# Altium schematic sheet BRZ_BATT_MGR.SchDoc
size C; SheetNumber: 1; SheetTotal: 8
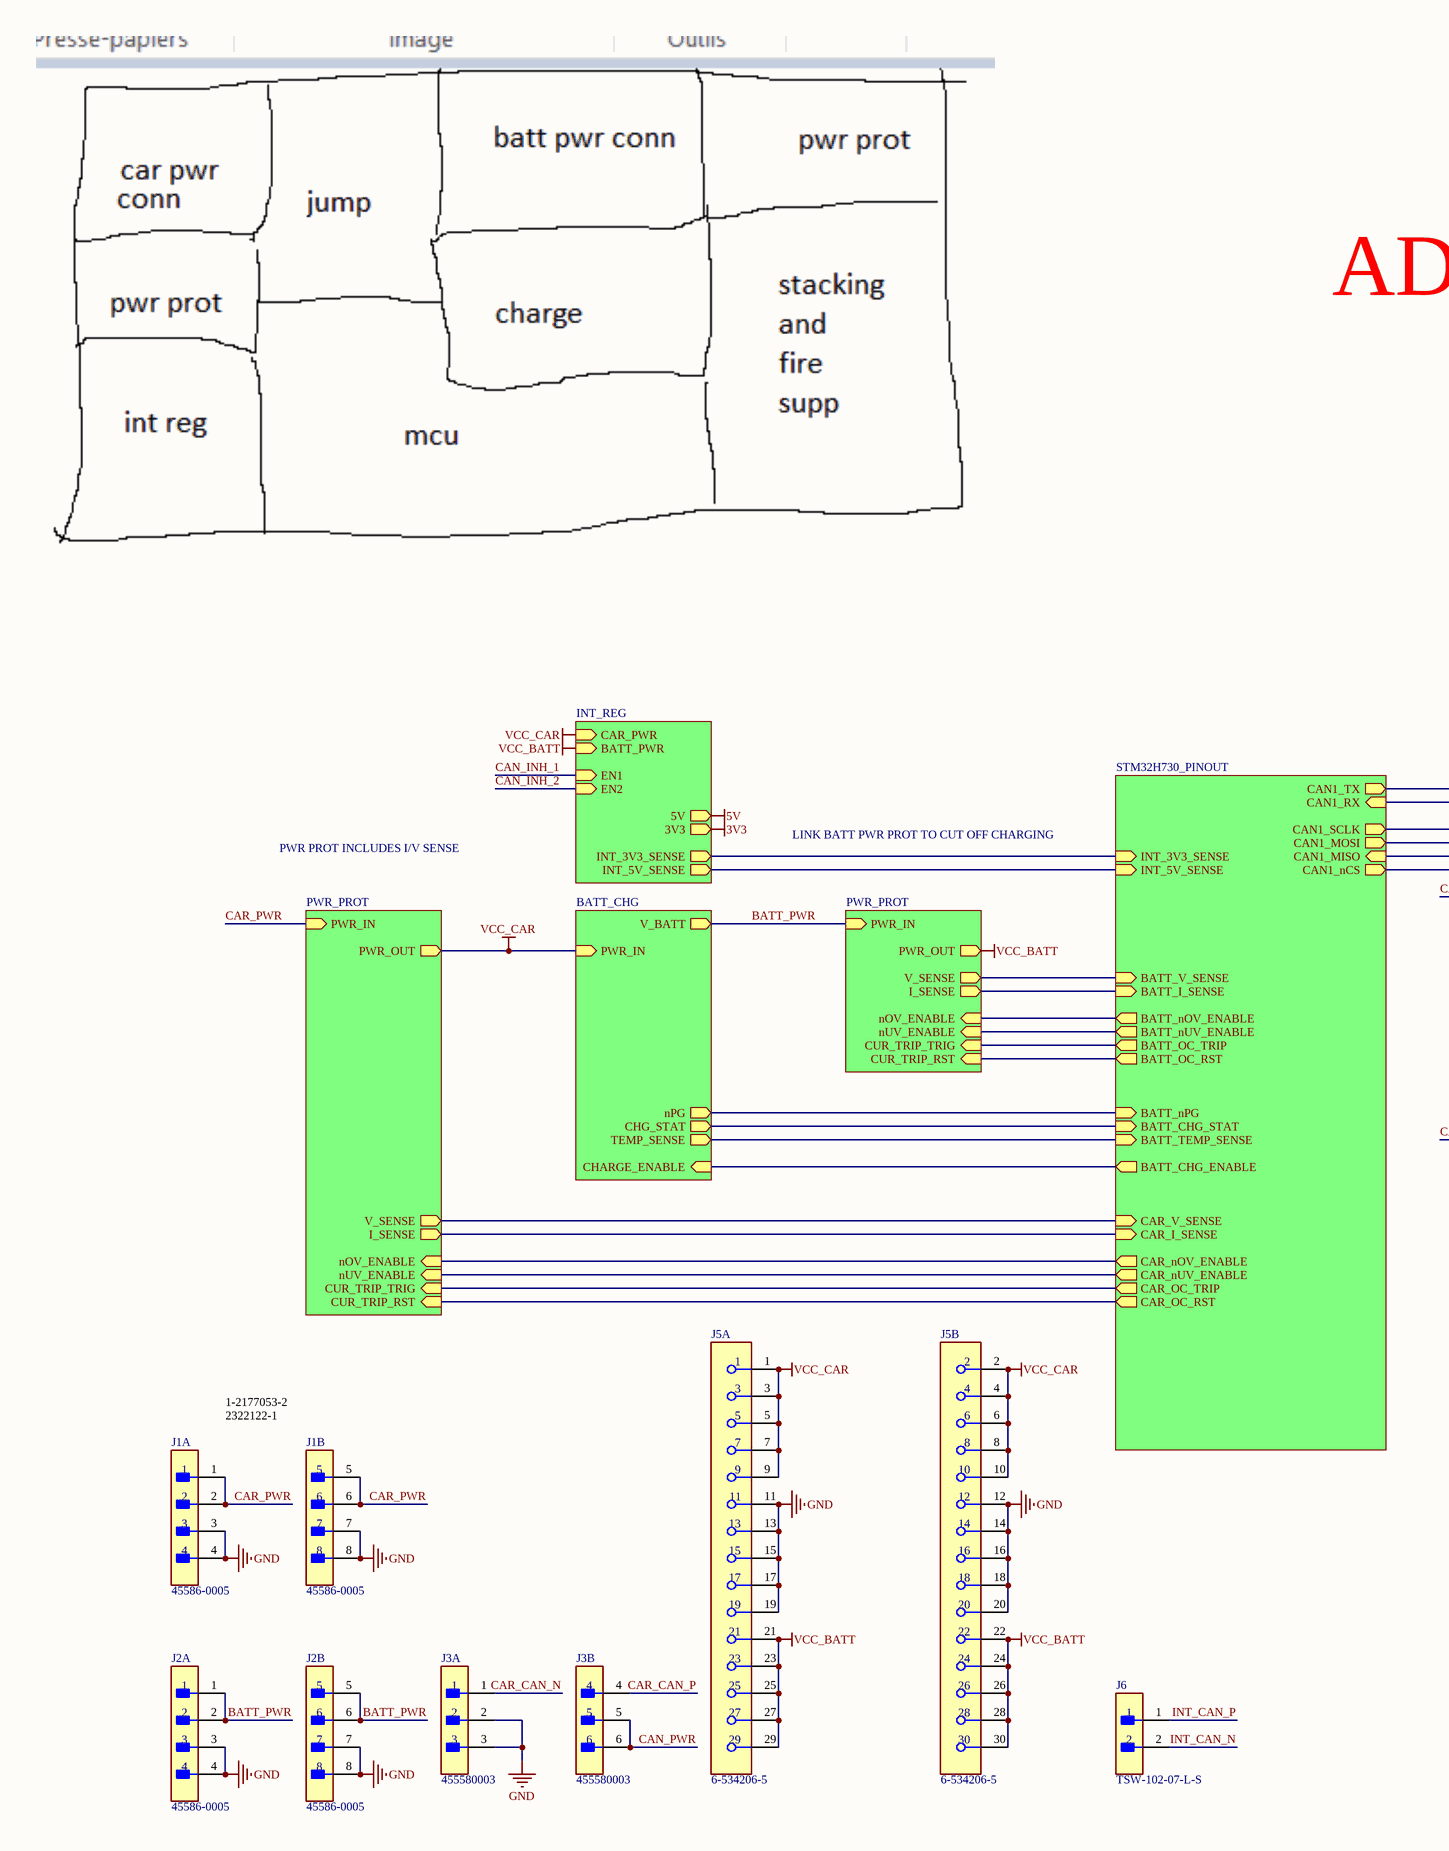
[diagram p0: BRZ_BATT_MGR.SchDoc, left]
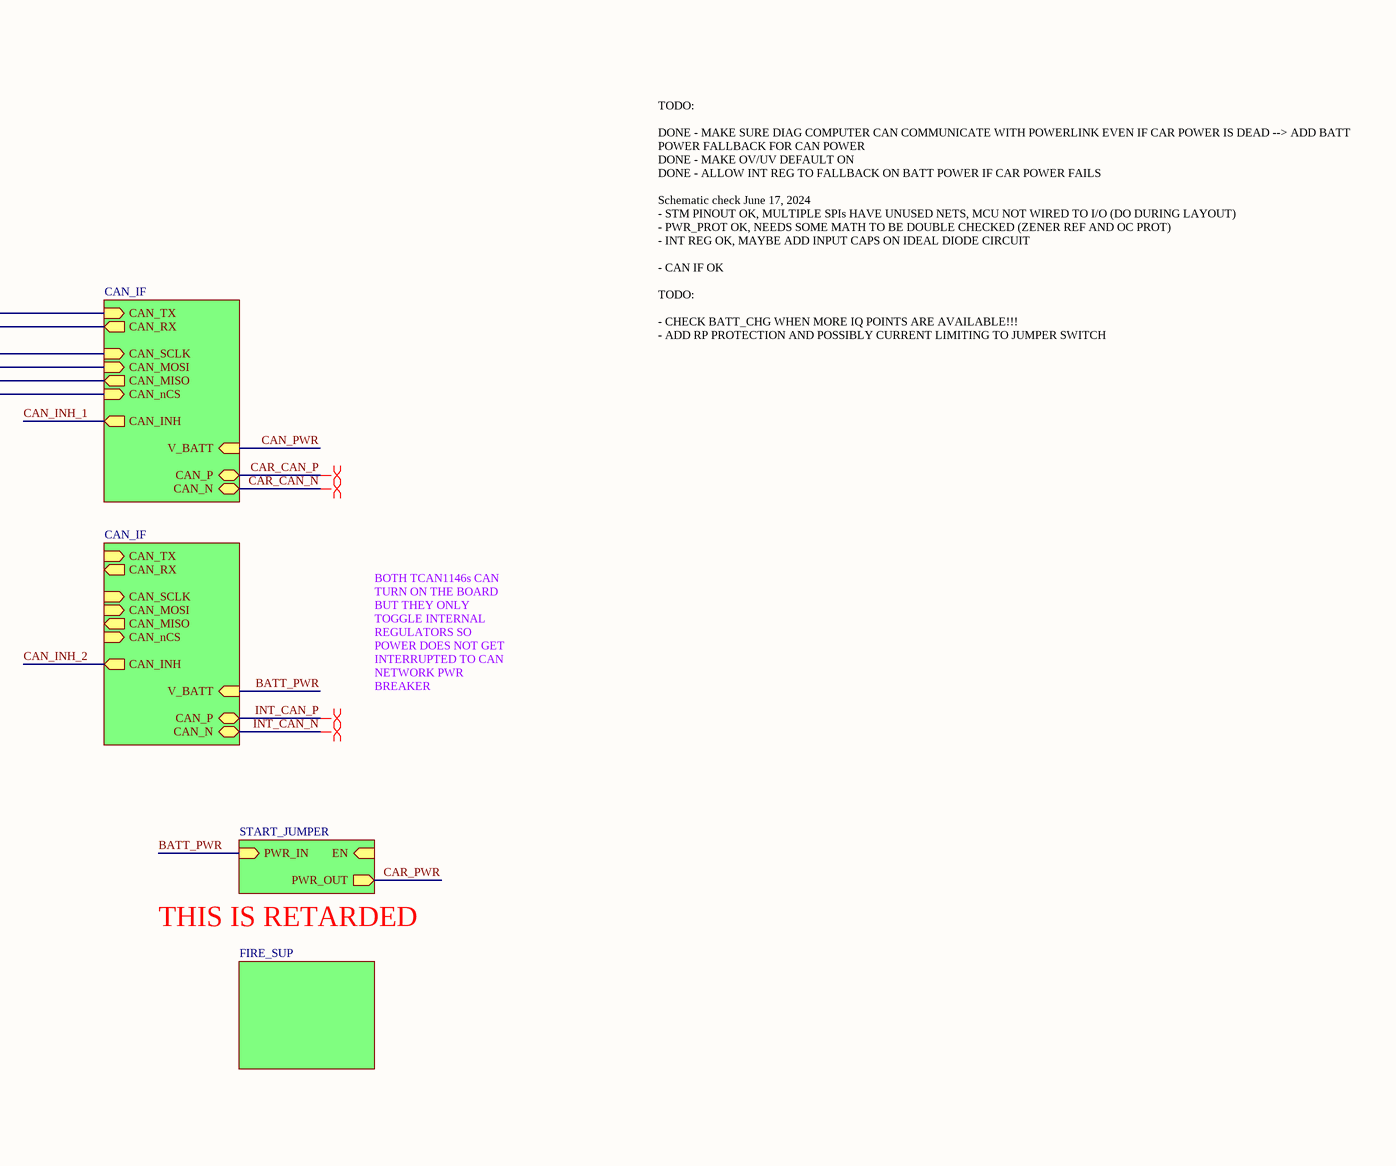
[diagram p1: BRZ_BATT_MGR.SchDoc, right]

## Parts
J1  45586-0005  [FP-45586-0005-MFG]  (parts A,B of 2)
J2  45586-0005  [FP-45586-0005-MFG]  (parts A,B of 2)
J3  455580003  [FP-455580003-MFG]  (parts A,B of 2)
J5  6-534206-5  [FP-6-534206-5-MFG]  (parts A,B of 2)
J6  TSW-102-07-L-S  [FP-TSW-102-07-L-S-MFG]

## Sub-sheets
BATT_CHG = BATT_CHG: PWR_IN (in), V_BATT (out), nPG (out), CHG_STAT (out), TEMP_SENSE (out), CHARGE_ENABLE (in)
CAN_IF_0 = CAN_IF: CAN_TX (in), CAN_RX (out), CAN_SCLK (in), CAN_MISO (out), CAN_MOSI (in), CAN_nCS (in), V_BATT (in), CAN_INH (out), CAN_P (bidir), CAN_N (bidir)
CAN_IF_1 = CAN_IF: CAN_TX (in), CAN_RX (out), CAN_SCLK (in), CAN_MISO (out), CAN_MOSI (in), CAN_nCS (in), CAN_P (bidir), CAN_N (bidir), V_BATT (in), CAN_INH (out)
FIRE_SUP = FIRE_SUP: no entries
INT_REG = INT_REG: INT_3V3_SENSE (out), INT_5V_SENSE (out), 5V (out), 3V3 (out), EN1 (in), EN2 (in), CAR_PWR (in), BATT_PWR (in)
MCU = STM32H730_PINOUT: INT_3V3_SENSE (in), INT_5V_SENSE (in), BATT_V_SENSE (in), BATT_I_SENSE (in), BATT_nOV_ENABLE (out), BATT_nUV_ENABLE (out), BATT_OC_TRIP (out), BATT_OC_RST (out), BATT_nPG (in), BATT_CHG_STAT (in), BATT_TEMP_SENSE (in), BATT_CHG_ENABLE (out), CAR_V_SENSE (in), CAR_I_SENSE (in), CAR_nOV_ENABLE (out), CAR_nUV_ENABLE (out), CAR_OC_TRIP (out), CAR_OC_RST (out), CAN1_TX (out), CAN1_RX (in), CAN1_SCLK (out), CAN1_MOSI (out), CAN1_MISO (in), CAN1_nCS (out)
PWR_PROT_0 = PWR_PROT: PWR_OUT (out), PWR_IN (in), V_SENSE (out), I_SENSE (out), CUR_TRIP_RST (in), CUR_TRIP_TRIG (in), nOV_ENABLE (in), nUV_ENABLE (in)
PWR_PROT_2 = PWR_PROT: PWR_OUT (out), PWR_IN (in), V_SENSE (out), I_SENSE (out), CUR_TRIP_TRIG (in), CUR_TRIP_RST (in), nOV_ENABLE (in), nUV_ENABLE (in)
START_JUMPER = START_JUMPER: PWR_IN (in), PWR_OUT (out), EN (in)

## Nets
3V3: sheet INT_REG/3V3
5V: sheet INT_REG/5V
GND: J1.3 J1.4 J1.7 J1.8 J2.3 J2.4 J2.7 J2.8 J3.2 J3.3 J5.11 J5.12 J5.13 J5.14 J5.15 J5.16 J5.17 J5.18 J5.19 J5.20
VCC_BATT: J5.21 J5.22 J5.23 J5.24 J5.25 J5.26 J5.27 J5.28 J5.29 J5.30 ; sheet INT_REG/BATT_PWR, sheet PWR_PROT_2/PWR_OUT
VCC_CAR: J5.1 J5.2 J5.3 J5.4 J5.5 J5.6 J5.7 J5.8 J5.9 J5.10 ; sheet PWR_PROT_0/PWR_OUT, sheet INT_REG/CAR_PWR, sheet BATT_CHG/PWR_IN
BATT_PWR: J2.1 J2.2 J2.5 J2.6 ; sheet BATT_CHG/V_BATT, sheet PWR_PROT_2/PWR_IN, sheet CAN_IF_1/V_BATT, sheet START_JUMPER/PWR_IN
CAN_INH_1: sheet INT_REG/EN1, sheet CAN_IF_0/CAN_INH
CAN_INH_2: sheet INT_REG/EN2, sheet CAN_IF_1/CAN_INH
CAN_PWR: J3.5 J3.6 ; sheet CAN_IF_0/V_BATT
CAR_CAN_N: J3.1 ; sheet CAN_IF_0/CAN_N
CAR_CAN_P: J3.4 ; sheet CAN_IF_0/CAN_P
CAR_PWR: J1.1 J1.2 J1.5 J1.6 ; sheet PWR_PROT_0/PWR_IN, sheet START_JUMPER/PWR_OUT
INT_CAN_N: J6.2 ; sheet CAN_IF_1/CAN_N
INT_CAN_P: J6.1 ; sheet CAN_IF_1/CAN_P
(unnamed): sheet PWR_PROT_0/V_SENSE, sheet MCU/CAR_V_SENSE
(unnamed): sheet PWR_PROT_0/I_SENSE, sheet MCU/CAR_I_SENSE
(unnamed): sheet PWR_PROT_0/CUR_TRIP_RST, sheet MCU/CAR_OC_RST
(unnamed): sheet PWR_PROT_0/CUR_TRIP_TRIG, sheet MCU/CAR_OC_TRIP
(unnamed): sheet PWR_PROT_0/nOV_ENABLE, sheet MCU/CAR_nOV_ENABLE
(unnamed): sheet PWR_PROT_0/nUV_ENABLE, sheet MCU/CAR_nUV_ENABLE
(unnamed): sheet INT_REG/INT_3V3_SENSE, sheet MCU/INT_3V3_SENSE
(unnamed): sheet INT_REG/INT_5V_SENSE, sheet MCU/INT_5V_SENSE
(unnamed): sheet BATT_CHG/nPG, sheet MCU/BATT_nPG
(unnamed): sheet BATT_CHG/CHG_STAT, sheet MCU/BATT_CHG_STAT
(unnamed): sheet BATT_CHG/TEMP_SENSE, sheet MCU/BATT_TEMP_SENSE
(unnamed): sheet BATT_CHG/CHARGE_ENABLE, sheet MCU/BATT_CHG_ENABLE
(unnamed): sheet MCU/BATT_V_SENSE, sheet PWR_PROT_2/V_SENSE
(unnamed): sheet MCU/BATT_I_SENSE, sheet PWR_PROT_2/I_SENSE
(unnamed): sheet MCU/BATT_nOV_ENABLE, sheet PWR_PROT_2/nOV_ENABLE
(unnamed): sheet MCU/BATT_nUV_ENABLE, sheet PWR_PROT_2/nUV_ENABLE
(unnamed): sheet MCU/BATT_OC_TRIP, sheet PWR_PROT_2/CUR_TRIP_TRIG
(unnamed): sheet MCU/BATT_OC_RST, sheet PWR_PROT_2/CUR_TRIP_RST
(unnamed): sheet MCU/CAN1_TX, sheet CAN_IF_0/CAN_TX
(unnamed): sheet MCU/CAN1_RX, sheet CAN_IF_0/CAN_RX
(unnamed): sheet MCU/CAN1_SCLK, sheet CAN_IF_0/CAN_SCLK
(unnamed): sheet MCU/CAN1_MOSI, sheet CAN_IF_0/CAN_MOSI
(unnamed): sheet MCU/CAN1_MISO, sheet CAN_IF_0/CAN_MISO
(unnamed): sheet MCU/CAN1_nCS, sheet CAN_IF_0/CAN_nCS

## Layout directives
differential pair: CAR_CAN_N, CAR_CAN_P, INT_CAN_N, INT_CAN_P

## Notes on the sheet
- ADD A PDU HERE
- PWR PROT INCLUDES I/V SENSE
- LINK BATT PWR PROT TO CUT OFF CHARGING
- TODO:
  DONE - MAKE SURE DIAG COMPUTER CAN COMMUNICATE WITH POWERLINK EVEN IF CAR POWER IS DEAD --> ADD BATT POWER FALLBACK FOR CAN POWER
  DONE - MAKE OV/UV DEFAULT ON
  DONE - ALLOW INT REG TO FALLBACK ON BATT POWER IF CAR POWER FAILS
  Schematic check June 17, 2024
  - STM PINOUT OK, MULTIPLE SPIs HAVE UNUSED NETS, MCU NOT WIRED TO I/O (DO DURING LAYOUT)
  - PWR_PROT OK, NEEDS SOME MATH TO BE DOUBLE CHECKED (ZENER REF AND OC PROT)
  - INT REG OK, MAYBE ADD INPUT CAPS ON IDEAL DIODE CIRCUIT
  - CAN IF OK
  TODO:
  - CHECK BATT_CHG WHEN MORE IQ POINTS ARE AVAILABLE!!!
  - ADD RP PROTECTION AND POSSIBLY CURRENT LIMITING TO JUMPER SWITCH
- BOTH TCAN1146s CAN TURN ON THE BOARD BUT THEY ONLY TOGGLE INTERNAL REGULATORS SO POWER DOES NOT GET INTERRUPTED TO CAN NETWORK PWR BREAKER
- THIS IS RETARDED
- 1-2177053-2
  2322122-1

## Library data of the parts
J1 J2 = CMP-04776-000690-1: CONN HEADER R/A 8POS 4.2MM
J3 = CMP-04776-000024-1: CONN HEADER R/A 6POS 4.2MM; Manufacturer: Molex; Standoff Height: 0.4mm; Conn Orientation: Right Angle; Number Of Contacts: 6; Conn Gender: Male; Voltage Rating: 600V; Current Rating: 8A; Footprint Url: https://www.molex.com/pdm_docs/sd/455580003_sd.pdf; Number Of Rows: 2; Lead Free: Yes; Digikey Description: CONN HEADER R/A 6POS 4.2MM; ComponentLink2URL: https://www.molex.com/webdocs/datasheets/pdf/en-us/0455580003_PCB_HEADERS.pdf; Octopart: https://octopart.com/45558-0003-molex-7672845; Package: 0; Device Class L3: unset; ComponentLink2Description: Datasheet; Device Class L2: Headers and Wire Housings; Category: Conn; Contact Material: Tin,Nickel; Mouser Description: Conn Power HDR 6 POS 4.2mm Solder ST Thru-Hole 6 Terminal 1 Port Mini-Fit Jr™ Tray; Manufacturer Part Number: 455580003; Pitch: 4.2mm; Device Class L1: Connectors; Temperature Range Low: -40°C; Temperature: -40°C to +105°C; RoHS: TRUE; Temperature Range High: +105°C; Height: 10.38mm; Automotive: No
J5 = CMP-03369-000056-1: CONN RCPT 30POS 0.1 GOLD PCB; Manufacturer: TE; Number Of Contacts: 30; Is Female: yes; Pitch: 2.54mm; Conn Gender: Female; Standoff Height: 0.38mm; Conn Orientation: Vertical; Current Rating: 2A; Lead Free: Yes; Category: Conn; Mouser Description: Headers & Wire Housings REC 2X15P VRT T/H; Device Class L3: unset; Height: 8.9mm; ComponentLink2Description: Datasheet; Manufacturer Part Number: 6-534206-5; RoHS: TRUE; ComponentLink2URL: https://www.te.com/commerce/DocumentDelivery/DDEController?Action=showdoc&DocId=Specification+Or+Standard%7F114-25018%7FE%7Fpdf%7FEnglish%7FENG_SS_114-25018_E.pdf%7F6-534206-5; Temperature: -65°C to +105°C; Temperature Range Low: -65°C; Footprint Url: https://www.te.com/commerce/DocumentDelivery/DDEController?Action=showdoc&DocId=Customer+Drawing%7F534206%7FR7%7Fpdf%7FEnglish%7FENG_CD_534206_R7.pdf%7F6-534206-5; Contact Material: Gold,Nickel; Automotive: No; Package: 0; Device Class L2: Headers and Wire Housings; Device Class L1: Connectors; Temperature Range High: +105°C; Number Of Rows: 2; Digikey Description: CONN RCPT 30POS 0.1 GOLD PCB; Octopart: https://octopart.com/6-534206-5-te+connectivity-39516817
J6 = CMP-02766-001428-1: CONN HEADER VERT 2POS 2.54MM; Voltage Rating: 550V; Current Rating: 7.6A; Gender: Male; Number of Contacts: 2; Connector Type: Male Pin; Radiation Hardening: No; Orientation: Straight; Contact Plating: Gold; Max Operating Temperature: 125°C; Mount: Through Hole; Package Quantity: 1; Number of Rows: 1; Housing Material: Polyester; RoHS Compliant: Yes; Length: 5.08mm; Max Voltage Rating (AC): 550V; Pitch: 2.54mm; Packaging: Bulk; Depth: 2.54mm; Termination: Solder; Min Operating Temperature: -55°C; Housing Color: Black; Lead Free: Lead Free; Color: Black; Number of Positions: 2; Width: 2.54mm; Max Current Rating: 7.6A; REACH SVHC: No SVHC; Contact Material: Bronze; Contact Mating Length: 0.23inch; Series: TSW; Contact Type: Male Pin